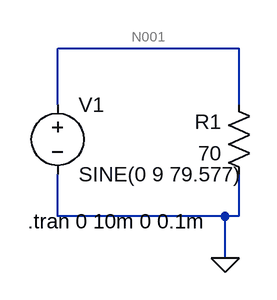
[diagram p0: schematic Draft1.asc]
Draft1.asc, the LTspice schematic file:
Version 4
SHEET 1 880 680
WIRE 352 48 144 48
WIRE 144 112 144 48
WIRE 352 112 352 48
WIRE 144 240 144 192
WIRE 336 240 144 240
WIRE 352 240 352 192
WIRE 352 240 336 240
WIRE 336 288 336 240
FLAG 336 288 0
SYMBOL res 368 208 R180
WINDOW 0 36 76 Left 2
WINDOW 3 36 40 Left 2
SYMATTR InstName R1
SYMATTR Value 70
SYMBOL voltage 144 96 R0
WINDOW 123 0 0 Left 0
WINDOW 39 0 0 Left 0
SYMATTR InstName V1
SYMATTR Value SINE(0 9 79.577)
TEXT 110 246 Left 2 !.tran 0 10m 0 0.1m

The netlist it stands for:
* Draft1.asc
R1 0 N001 70
V1 N001 0 SINE(0 9 79.577)
.tran 0 10m 0 0.1m
.backanno
.end

* Results of the author's LTspice run, read from the files saved beside the schematic
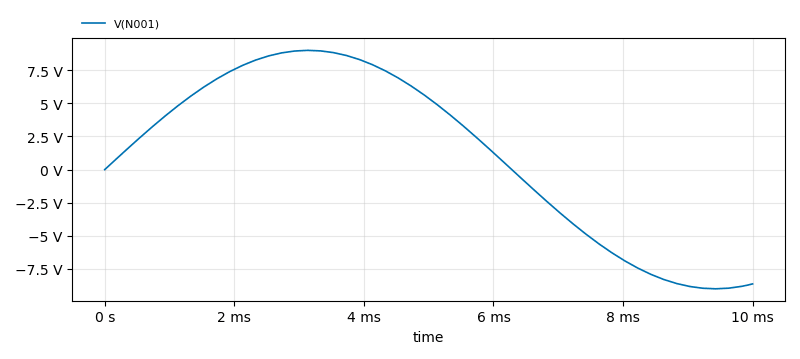
[diagram p1: Transient Analysis of Draft1.asc, plotted from the saved traces]
* Transient Analysis, 1 run:
*   V(N001): min -9 V, max 9 V, average 1.288 V, rms 6.535 V, last -8.63 V